# Altium schematic sheet MCU.SchDoc
size A3; SheetNumber: 1; SheetTotal: 4
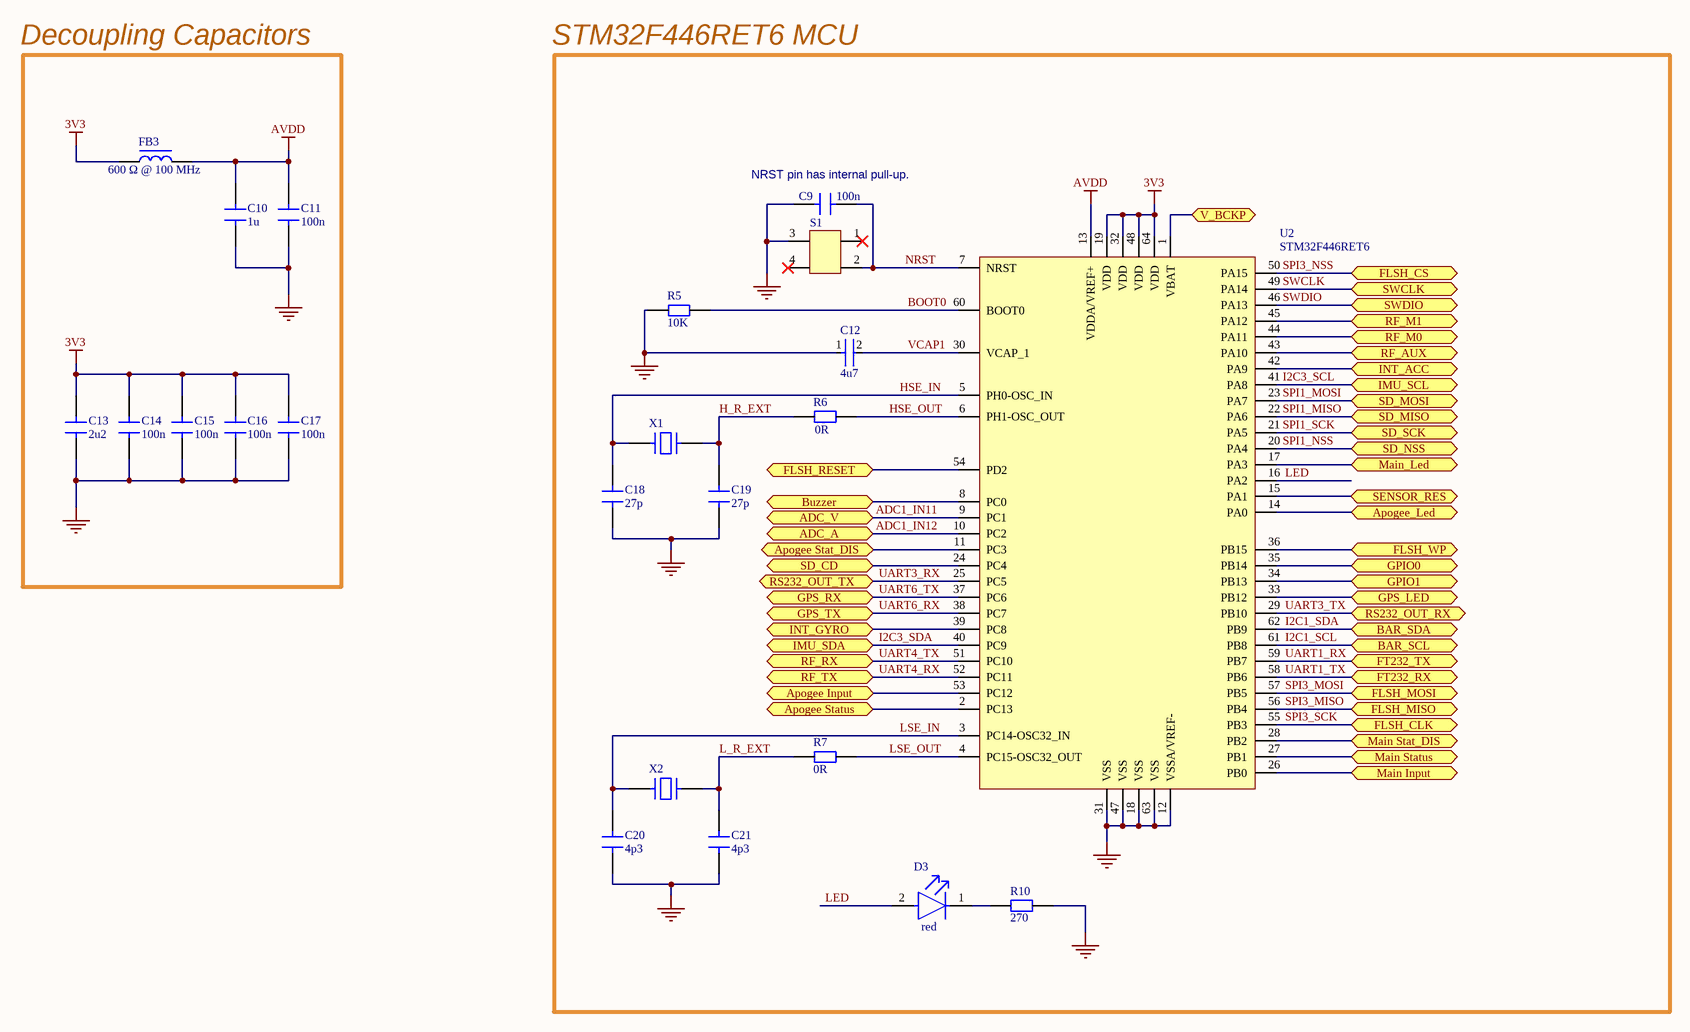
[diagram p0: MCU.SchDoc]

## Parts
C9  100n  [CAP 0603]
C10  1u  [CAP 0805]
C11  100n  [CAP 0805]
C12  4u7  [FP-1206-L_3_2_0_2-W_1_6_0-IPC_A]
C13  2u2  [CAP 0805]
C14  100n  [CAP 0805]
C15  100n  [CAP 0805]
C16  100n  [CAP 0805]
C17  100n  [CAP 0805]
C18  27p  [CAP 0805]
C19  27p  [CAP 0805]
C20  4p3  [CAP 0805]
C21  4p3  [CAP 0805]
D3  red  [FP-LTST-C170GKT-MFG]
FB3  600 Ω @ 100 MHz  [FB 0805]
R5  10K  [RES 0805]
R6  0R  [RES 0805]
R7  0R  [RES 0805]
R10  270  [RES 0805]
S1  FSM4JSMATR  [FSM4JSMATR]  (value not drawn)
U2  STM32F446RET6  [STM32F446RET6]
X1  ABM3-8.000MHZ-D2Y-T  [ABM3-8.000MHZ-D2Y-T]  (value not drawn)
X2  ABS25-32.768KHZ-6-T  [ABS25-32.768KHZ-6-T]  (value not drawn)

## Blocks framed on the sheet
Decoupling Capacitors: C10 C11 C13-C17 FB3
STM32F446RET6 MCU: C9 C12 C18-C21 D3 R5-R7 R10 S1 U2 X1 X2

## Ports
ADC_A (bidir, see Power[2D]), ADC_V (bidir, see Power[1C]), Apogee Input (bidir, see Peripherals[4D]), Apogee Stat_DIS (bidir, see Peripherals[4D]), Apogee Status (bidir, see Peripherals[4D]), Apogee_Led (bidir, see Peripherals[7D]), BAR_SCL (bidir, see Connectors[7C], Peripherals[6A]), BAR_SDA (bidir, see Connectors[7C], Peripherals[6A]), Buzzer (bidir, see Peripherals[1C]), FLSH_CLK (bidir, see Peripherals[6A]), FLSH_CS (bidir, see Peripherals[4A]), FLSH_MISO (bidir, see Peripherals[4B]), FLSH_MOSI (bidir, see Peripherals[6A]), FLSH_RESET (bidir, see Peripherals[6A]), FLSH_WP (bidir, see Peripherals[6A]), FT232_RX (bidir, see Connectors[2A]), FT232_TX (bidir, see Connectors[2A]), GPIO0 (bidir, see Connectors[3C]), GPIO1 (bidir, see Connectors[3C]), GPS_LED (bidir, see Peripherals[1B]), GPS_RX (bidir, see Peripherals[2A]), GPS_TX (bidir, see Peripherals[2A]), IMU_SCL (bidir, see Connectors[7C], Peripherals[6B]), IMU_SDA (bidir, see Connectors[7C], Peripherals[6B]), INT_ACC (bidir, see Peripherals[8B]), INT_GYRO (bidir, see Peripherals[8B]), Main Input (bidir, see Peripherals[6D]), Main Stat_DIS (bidir, see Peripherals[6D]), Main Status (bidir, see Peripherals[6D]), Main_Led (bidir, see Peripherals[4D]), RF_AUX (bidir, see Peripherals[5B]), RF_M0 (bidir, see Peripherals[5B]), RF_M1 (bidir, see Peripherals[5B]), RF_RX (bidir, see Peripherals[5B]), RF_TX (bidir, see Peripherals[5B]), RS232_OUT_RX (bidir, see Peripherals[2D]), RS232_OUT_TX (bidir, see Peripherals[3D]), SD_CD (bidir, see Connectors[5B]), SD_MISO (bidir, see Connectors[5A]), SD_MOSI (bidir, see Connectors[5A]), SD_NSS (bidir, see Connectors[5B]), SD_SCK (bidir, see Connectors[5A]), SENSOR_RES (bidir, see Power[4C]), SWCLK (bidir, see Connectors[1C]), SWDIO (bidir, see Connectors[1C]), V_BCKP (bidir, see Peripherals[2A], Power[3C])

## Nets
3V3: C13.2 C14.2 C15.2 C16.2 C17.2 FB3.1 U2.19(VDD) U2.32(VDD) U2.48(VDD) U2.64(VDD)
AVDD: C10.2 C11.2 FB3.2 U2.13(VDDA/VREF+)
GND: C9.1 C10.1 C11.1 C12.1 C13.1 C14.1 C15.1 C16.1 C17.1 C18.1 C19.1 C20.1 C21.1 R5.1 R10.1 S1.3 U2.12(VSSA/VREF-) U2.18(VSS) U2.31(VSS) U2.47(VSS) U2.63(VSS)
ADC1_IN11: U2.9(PC1) ; port ADC_V
ADC1_IN12: U2.10(PC2) ; port ADC_A
Apogee Input: U2.53(PC12) ; port Apogee Input
Apogee Stat_DIS: U2.11(PC3) ; port Apogee Stat_DIS
Apogee Status: U2.2(PC13) ; port Apogee Status
Apogee_Led: U2.14(PA0) ; port Apogee_Led
BOOT0: R5.2 U2.60(BOOT0)
Buzzer: U2.8(PC0) ; port Buzzer
FLSH_RESET: U2.54(PD2) ; port FLSH_RESET
FLSH_WP: U2.36(PB15) ; port FLSH_WP
GPIO0: U2.35(PB14) ; port GPIO0
GPIO1: U2.34(PB13) ; port GPIO1
GPS_LED: U2.33(PB12) ; port GPS_LED
H_R_EXT: C19.2 R6.1 X1.2
HSE_IN: C18.2 U2.5(PH0-OSC_IN) X1.1
HSE_OUT: R6.2 U2.6(PH1-OSC_OUT)
I2C1_SCL: U2.61(PB8) ; port BAR_SCL
I2C1_SDA: U2.62(PB9) ; port BAR_SDA
I2C3_SCL: U2.41(PA8) ; port IMU_SCL
I2C3_SDA: U2.40(PC9) ; port IMU_SDA
INT_ACC: U2.42(PA9) ; port INT_ACC
INT_GYRO: U2.39(PC8) ; port INT_GYRO
L_R_EXT: C21.2 R7.1 X2.4
LED: D3.2(A) U2.16(PA2)
LSE_IN: C20.2 U2.3(PC14-OSC32_IN) X2.1
LSE_OUT: R7.2 U2.4(PC15-OSC32_OUT)
Main Input: U2.26(PB0) ; port Main Input
Main Stat_DIS: U2.28(PB2) ; port Main Stat_DIS
Main Status: U2.27(PB1) ; port Main Status
Main_Led: U2.17(PA3) ; port Main_Led
NRST: C9.2 S1.2 U2.7(NRST)
RF_AUX: U2.43(PA10) ; port RF_AUX
RF_M0: U2.44(PA11) ; port RF_M0
RF_M1: U2.45(PA12) ; port RF_M1
SD_CD: U2.24(PC4) ; port SD_CD
SENSOR_RES: U2.15(PA1) ; port SENSOR_RES
SPI1_MISO: U2.22(PA6) ; port SD_MISO
SPI1_MOSI: U2.23(PA7) ; port SD_MOSI
SPI1_NSS: U2.20(PA4) ; port SD_NSS
SPI1_SCK: U2.21(PA5) ; port SD_SCK
SPI3_MISO: U2.56(PB4) ; port FLSH_MISO
SPI3_MOSI: U2.57(PB5) ; port FLSH_MOSI
SPI3_NSS: U2.50(PA15) ; port FLSH_CS
SPI3_SCK: U2.55(PB3) ; port FLSH_CLK
SWCLK: U2.49(PA14) ; port SWCLK
SWDIO: U2.46(PA13) ; port SWDIO
UART1_RX: U2.59(PB7) ; port FT232_TX
UART1_TX: U2.58(PB6) ; port FT232_RX
UART3_RX: U2.25(PC5) ; port RS232_OUT_TX
UART3_TX: U2.29(PB10) ; port RS232_OUT_RX
UART4_RX: U2.52(PC11) ; port RF_TX
UART4_TX: U2.51(PC10) ; port RF_RX
UART6_RX: U2.38(PC7) ; port GPS_TX
UART6_TX: U2.37(PC6) ; port GPS_RX
V_BCKP: U2.1(VBAT) ; port V_BCKP
VCAP1: C12.2 U2.30(VCAP_1)
NetD3_1: D3.1(C) R10.2

Not connected (* = marked no-connect by the designer): S1 1* 4*

## Notes on the sheet
- (near C9) NRST pin has internal pull-up.

## Library data of the parts
C9 = CAP 0603 50V: Capacitor SMD 0603 50V
C10 C11 C14-C21 = CAP 0805 50V: Capacitor SMD 0805 50V
C12 = CMP-14477-000781-2: None; Capacitance: 4.7uF; Voltage Rating: 50V; Tolerance: 20%; Min Operating Temperature: -55°C; RoHS Compliant: Yes; Case/Package: 1206; Mount: Surface Mount; Packaging: Tape and Reel; Max Operating Temperature: 85°C; Ratings: AEC-Q200
C13 = CAP 0805 25V: Capacitor SMD 0805 25V
D3 = CMP-1674-00002-6: LED GREEN CLEAR SMD; Dominant Wavelength: 569nm; Lens Style: Diffused; Forward Voltage: 2.1V; Number of Elements: 1; Wavelength: 565nm; Luminous Intensity: 6mcd; Test Current: 10mA; Power Dissipation: 100mW; Reverse Voltage: 5V; Forward Current: 30mA; Viewing Angle: 130°; Lens Color: Colorless; Min Operating Temperature: -55°C; Number of Pins: 2; Max Operating Temperature: 85°C; Color: Green; Radiation Hardening: No; Illumination Color: Green; Case Code (Metric): 2012; Lens Transparency: Clear; Case/Package: 0805; Width: 1.25mm; Case Code (Imperial): 0805; Package Quantity: 1; Height: 1.1mm; Depth: 1.25mm; Length: 2mm; Power Rating: 100mW; Lead Free: Lead Free; Number of LEDs: 1; Packaging: Tape and Reel; Mount: Surface Mount; Voltage: 5V
FB3 = FB 0805: Ferrite Bead SMD 0805
R5-R7 R10 = RES 0805: Resistor SMD 0805
S1 = FSM4JSMATR: Switch Tactile OFF (ON) SPST Round Button Gull Wing 0.05A 24VDC 1.57N SMD T/R; Manufacturer: TE Connectivity Alcoswitch; Supplier 1: Digi-Key; Manufacturer Part Number: FSM4JSMATR; RoHS: Yes; Category: Pushbutton Switches; Stock 1: 84996; Pricing 1: 1=0,36, 10=0,351, 25=0,33, 100=0,2866, 250=0,26, 500=0,24188 (USD); ComponentLink1URL: https://datasheet.ciiva.com/16320/eng-cs-1308111-1-switches-core-program-catalog-0308-16320065.pdf?src-supplier=Future+Electronics; ComponentLink1Description: https://datasheet.ciiva.com/16320/eng-cs-1308111-1-switches-core-program-catalog-0308-16320065.pdf?src-supplier=Future+Electronics; ComponentLink2URL: https://datasheet.ciiva.com/1530/1683375-1530944.pdf?src-supplier=Element14; ComponentLink2Description: https://datasheet.ciiva.com/1530/1683375-1530944.pdf?src-supplier=Element14; ComponentLink3URL: https://datasheet.ciiva.com/23765/1486934-23765878.pdf?src-supplier=Newark; ComponentLink3Description: https://datasheet.ciiva.com/23765/1486934-23765878.pdf?src-supplier=Newark; ComponentLink4URL: https://datasheet.ciiva.com/7638/921681-7638037.pdf?src-supplier=Element14; ComponentLink4Description: https://datasheet.ciiva.com/7638/921681-7638037.pdf?src-supplier=Element14
U2 = STM32F446RET6: ARM® Cortex®-M4 STM32 F4 Microcontroller IC 32-Bit 180MHz 512KB (512K x 8) FLASH 64-LQFP (10x10); Manufacturer: STMicroelectronics; Supplier 1: Mouser; Manufacturer Part Number: STM32F446RET6; RoHS: Yes; Category: Microcontrollers; Stock 1: 2954; Pricing 1: 1=12,45, 10=11,25, 50=10,54, 100=9,5, 1000=6,72, 10000=6,72 (USD); ComponentLink1URL: http://www.mouser.com/ds/2/389/stm32f446mc-956216.pdf?src-supplier=Mouser; ComponentLink1Description: http://www.mouser.com/ds/2/389/stm32f446mc-956216.pdf?src-supplier=Mouser; ComponentLink2URL: http://www.farnell.com/datasheets/2309063.pdf?src-supplier=Farnell; ComponentLink2Description: http://www.farnell.com/datasheets/2309063.pdf?src-supplier=Farnell; ComponentLink3URL: https://datasheet.octopart.com/STM32F446RET6-STMicroelectronics-datasheet-58295083.pdf?src-supplier=Future+Electronics; ComponentLink3Description: https://datasheet.octopart.com/STM32F446RET6-STMicroelectronics-datasheet-58295083.pdf?src-supplier=Future+Electronics; ComponentLink4URL: http://www.st.com/content/ccc/resource/technical/document/datasheet/65/cb/75/50/53/d6/48/24/DM00141306.pdf/files/DM00141306.pdf/jcr:content/translations/en.DM00141306.pdf?src-supplier=Digi-Key; ComponentLink4Description: http://www.st.com/content/ccc/resource/technical/document/datasheet/65/cb/75/50/53/d6/48/24/DM00141306.pdf/files/DM00141306.pdf/jcr:content/translations/en.DM00141306.pdf?src-supplier=Digi-Key; ComponentLink5URL: http://www.farnell.com/datasheets/2309063.pdf?src-supplier=Element14; ComponentLink5Description: http://www.farnell.com/datasheets/2309063.pdf?src-supplier=Element14; ComponentLink6URL: https://datasheet.octopart.com/STM32F446RET6-STMicroelectronics-datasheet-41797127.pdf?src-supplier=Element14; ComponentLink6Description: https://datasheet.octopart.com/STM32F446RET6-STMicroelectronics-datasheet-41797127.pdf?src-supplier=Element14; ComponentLink7URL: http://www.farnell.com/datasheets/2309063.pdf?src-supplier=Newark; ComponentLink7Description: http://www.farnell.com/datasheets/2309063.pdf?src-supplier=Newark; ComponentLink8URL: https://datasheet.octopart.com/STM32F446RET6-STMicroelectronics-datasheet-83961502.pdf?src-supplier=SHENGYU+ELECTRONICS; ComponentLink8Description: https://datasheet.octopart.com/STM32F446RET6-STMicroelectronics-datasheet-83961502.pdf?src-supplier=SHENGYU+ELECTRONICS
X1 = ABM3-8.000MHZ-D2Y-T: Crystal 8MHz ±20ppm (Tol) ±30ppm (Stability) 18pF FUND 140Ohm 2-Pin Mini-CSMD T/R; Manufacturer: Abracon; Supplier 1: Future Electronics; Manufacturer Part Number: ABM3-8.000MHZ-D2Y-T; RoHS: Yes; Category: Crystals; Stock 1: 237000; Pricing 1: 1000=0,325, 2000=0,275, 3000=0,315, 4000=0,27, 5000=0,31, 10000=0,305, 20000=0,295 (USD); Reach SVHC Compliant: 4187SVHC; ComponentLink1URL: https://datasheet.ciiva.com/862/abm3-862465.pdf?src-supplier=Digikey; ComponentLink1Description: https://datasheet.ciiva.com/862/abm3-862465.pdf?src-supplier=Digikey
X2 = ABS25-32.768KHZ-6-T: Crystal, Plastic Molded 32.768Khz, 6Pf, 20Ppm-40+85C, 8 X 3.8 X 2.5 Rohs Compliant: Yes; Manufacturer: Abracon; Supplier 1: Future Electronics; Manufacturer Part Number: ABS25-32.768KHZ-6-T; RoHS: Yes; Category: Crystals; Stock 1: 399000; Pricing 1: 3000=0,375, 6000=0,365, 9000=0,365, 12000=0,36, 15000=0,35 (USD); ComponentLink1URL: https://datasheet.ciiva.com/854/abs25-854528.pdf?src-supplier=Digi-Key; ComponentLink1Description: https://datasheet.ciiva.com/854/abs25-854528.pdf?src-supplier=Digi-Key; ComponentLink2URL: https://datasheet.ciiva.com/26909/getdatasheetpartid-722397-26909970.pdf?src-supplier=Verical; ComponentLink2Description: https://datasheet.ciiva.com/26909/getdatasheetpartid-722397-26909970.pdf?src-supplier=Verical; ComponentLink3URL: https://datasheet.ciiva.com/854/abs25-854527.pdf?src-supplier=Digi-Key; ComponentLink3Description: https://datasheet.ciiva.com/854/abs25-854527.pdf?src-supplier=Digi-Key; ComponentLink4URL: https://datasheet.ciiva.com/854/abs25-854529.pdf?src-supplier=Digi-Key; ComponentLink4Description: https://datasheet.ciiva.com/854/abs25-854529.pdf?src-supplier=Digi-Key; ComponentLink5URL: https://datasheet.ciiva.com/5788/abs25-5788102.pdf?src-supplier=Farnell; ComponentLink5Description: https://datasheet.ciiva.com/5788/abs25-5788102.pdf?src-supplier=Farnell; ComponentLink6URL: https://datasheet.ciiva.com/1357/1856019-1357324.pdf?src-supplier=Element14; ComponentLink6Description: https://datasheet.ciiva.com/1357/1856019-1357324.pdf?src-supplier=Element14; ComponentLink7URL: https://datasheet.ciiva.com/7998/1856019-7998662.pdf?src-supplier=Element14; ComponentLink7Description: https://datasheet.ciiva.com/7998/1856019-7998662.pdf?src-supplier=Element14